# Altium schematic sheet ADC-DAC.SchDoc
size A3; SheetNumber: 16; SheetTotal: 18
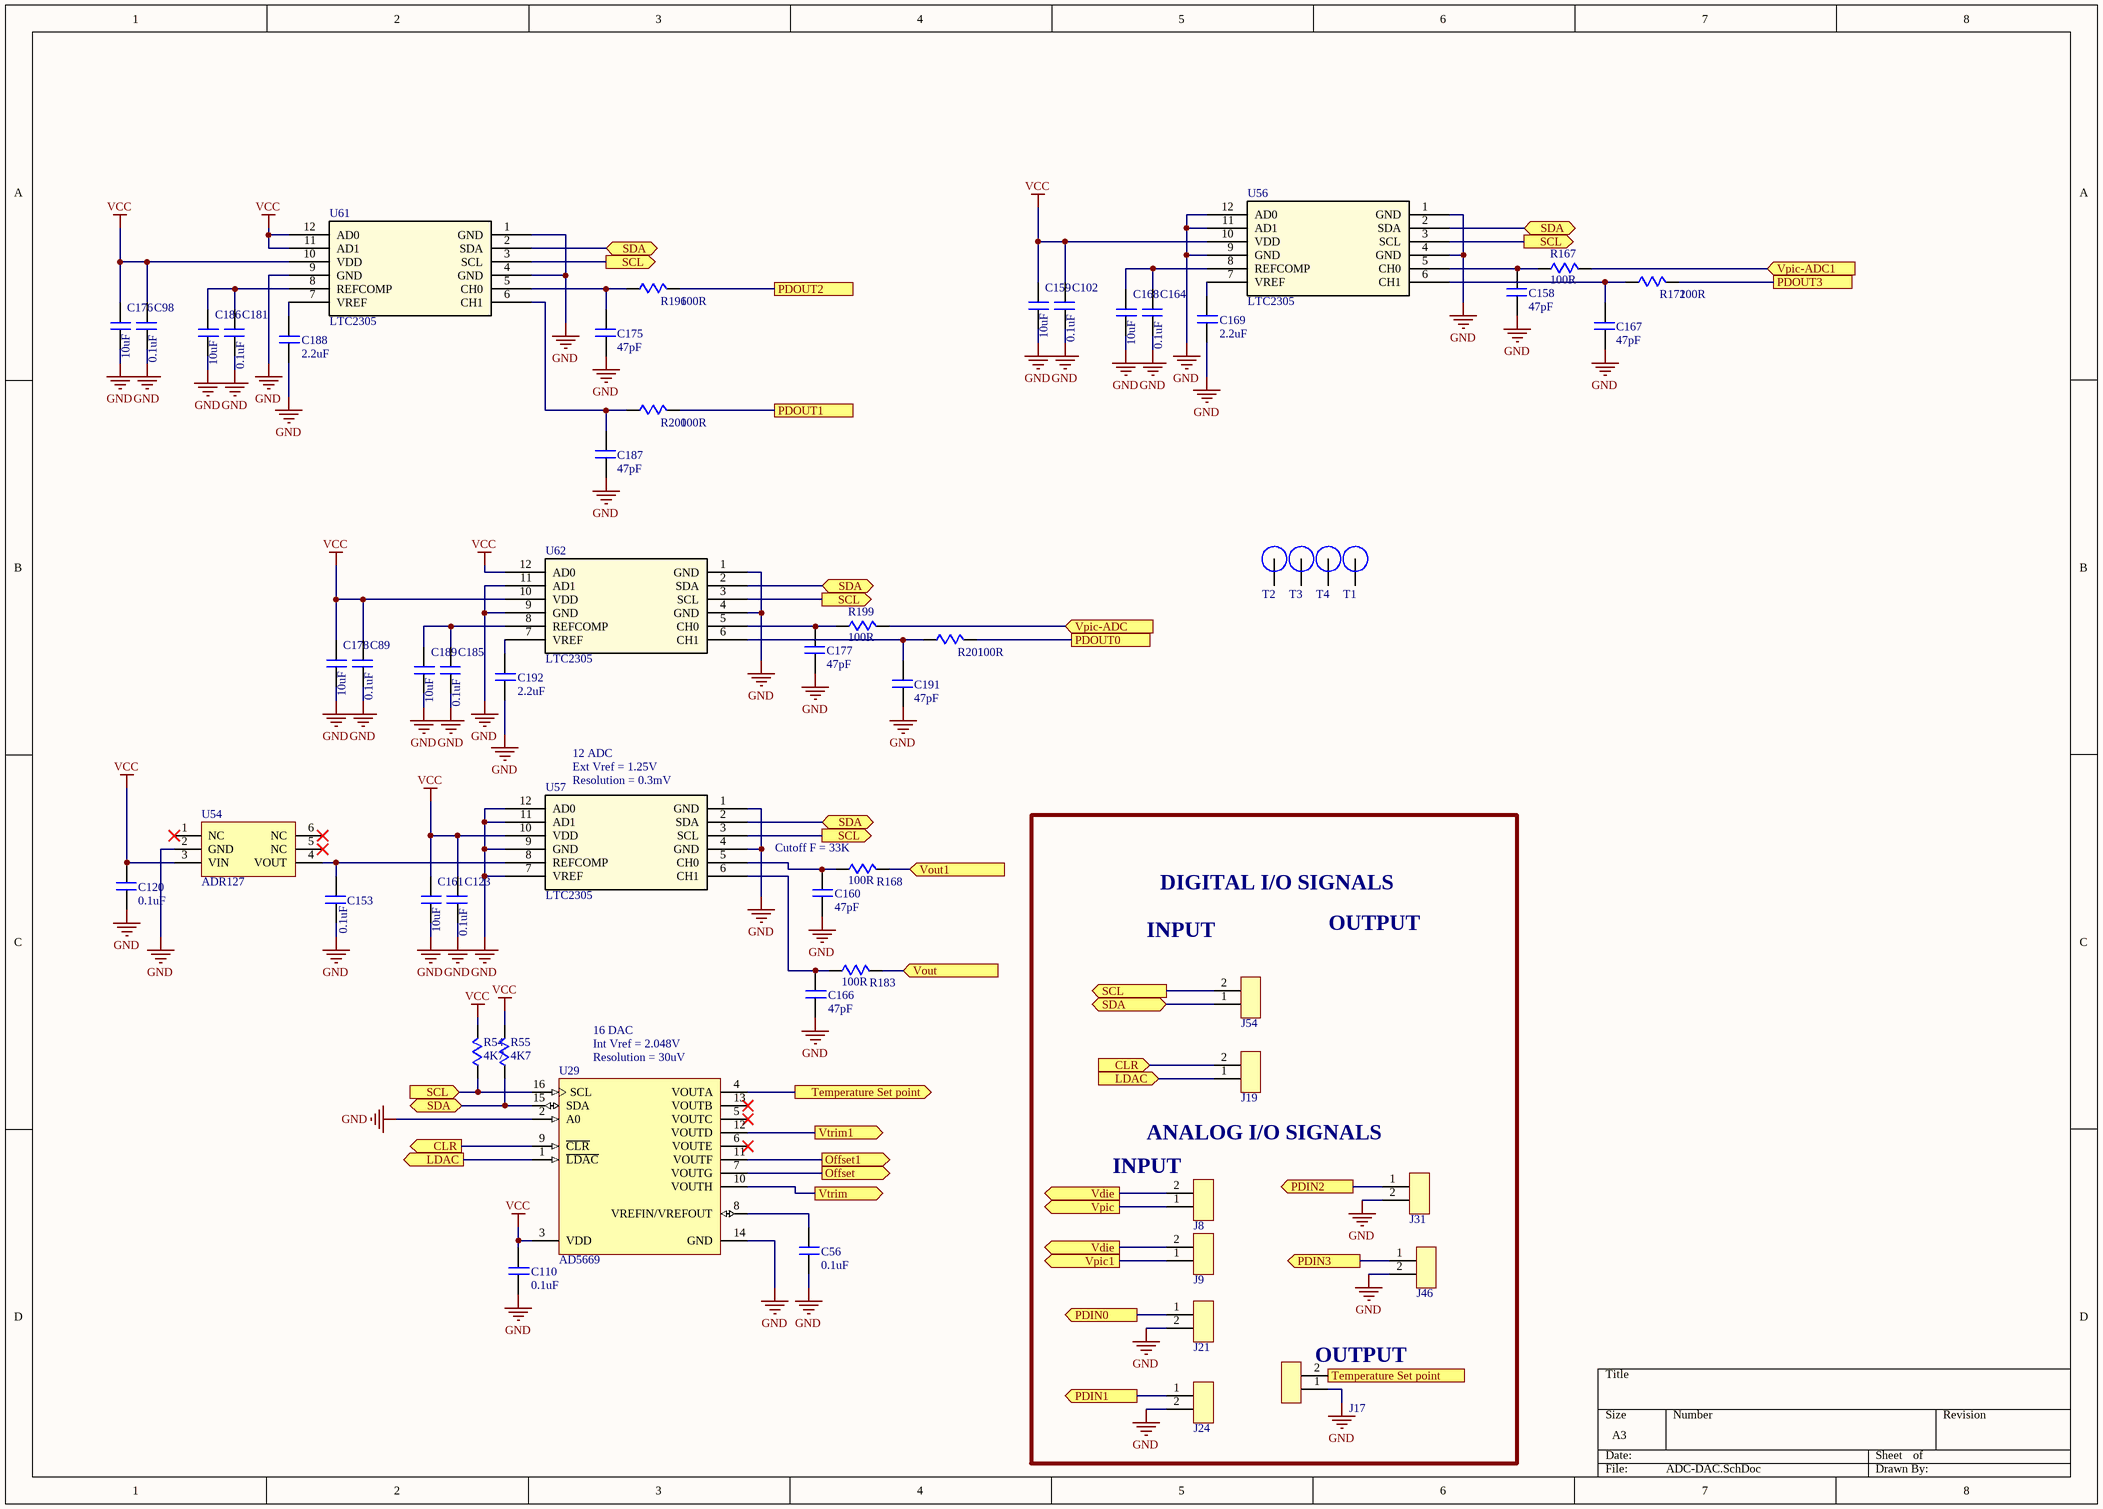
[diagram p0: ADC-DAC.SchDoc]

## Parts
C56  0.1uF  [CAP0603]
C89  0.1uF  [CAP0603]
C98  0.1uF  [CAP0603]
C102  0.1uF  [CAP0603]
C110  0.1uF  [CAP0603]
C120  0.1uF  [CAP0603]
C123  0.1uF  [CAP0603]
C153  0.1uF  [CAP0603]
C158  47pF  [CAP0805]
C159  10uF  [CAP0805]
C160  47pF  [CAP0805]
C161  10uF  [CAP0805]
C164  0.1uF  [CAP0603]
C166  47pF  [CAP0805]
C167  47pF  [CAP0805]
C168  10uF  [CAP0805]
C169  2.2uF  [CAP0603]
C175  47pF  [CAP0805]
C176  10uF  [CAP0805]
C177  47pF  [CAP0805]
C178  10uF  [CAP0805]
C181  0.1uF  [CAP0603]
C185  0.1uF  [CAP0603]
C186  10uF  [CAP0805]
C187  47pF  [CAP0805]
C188  2.2uF  [CAP0603]
C189  10uF  [CAP0805]
C191  47pF  [CAP0805]
C192  2.2uF  [CAP0603]
J8  Header1x2  [HEADER 1x2]  (value not drawn)
J9  Header1x2  [HEADER 1x2]  (value not drawn)
J17  Header1x2  [HEADER 1x2]  (value not drawn)
J19  Header1x2  [HEADER 1x2]  (value not drawn)
J21  Header1x2  [HEADER 1x2]  (value not drawn)
J24  Header1x2  [HEADER 1x2]  (value not drawn)
J31  Header1x2  [HEADER 1x2]  (value not drawn)
J46  Header1x2  [HEADER 1x2]  (value not drawn)
J54  Header1x2  [HEADER 1x2]  (value not drawn)
R54  4K7  [RES0805]
R55  4K7  [RES0805]
R167  100R  [RES0805]
R168  100R  [RES0805]
R172  100R  [RES0805]
R183  100R  [RES0805]
R196  100R  [RES0805]
R199  100R  [RES0805]
R200  100R  [RES0805]
R201  100R  [RES0805]
T1  TP  [Hole 3.3mm]  (value not drawn)
T2  TP  [Hole 3.3mm]  (value not drawn)
T3  TP  [Hole 3.3mm]  (value not drawn)
T4  TP  [Hole 3.3mm]  (value not drawn)
U29  AD5669  [TSSOP16]
U54  ADR127  [TSOT6]
U56  LTC2305  [MSOP12]
U57  LTC2305  [MSOP12]
U61  LTC2305  [MSOP12]
U62  LTC2305  [MSOP12]

## Ports
CLR (in, see ADC-DAC[2D]), CLR (out, see ADC-DAC[5C]), LDAC (in, see ADC-DAC[2D]), LDAC (out, see ADC-DAC[5C]), Offset1 (out, see PIC closed loop[1C]), Offset (out, see PIC closed loop[1B]), PDIN0 (out, see PD[1A]), PDIN1 (out, see PD[1B]), PDIN2 (out, see PD[1C]), PDIN3 (out, see PD[1D]), PDOUT0 (see PD[4A]), PDOUT1 (see PD[4B]), PDOUT2 (see PD[4C]), PDOUT3 (see PD[4D]), SCL (in, see ADC-DAC[3A], ADC-DAC[4B], ADC-DAC[4C], ADC-DAC[5C], ADC-DAC[6A], Fan & Power Out[6A], PI_INTERFACE[3A], TEC_CONTROLLER_1[6B], TEC_CONTROLLER_1[7A], TEC_CONTROLLER_1[8B]), SCL (out, see ADC-DAC[2C], ADC-DAC[3A], ADC-DAC[4B], ADC-DAC[4C], ADC-DAC[5C], Fan & Power Out[6A], PI_INTERFACE[3A], TEC_CONTROLLER_1[6B], TEC_CONTROLLER_1[7A], TEC_CONTROLLER_1[8B]), SCL (out, see ADC-DAC[2C], ADC-DAC[3A], ADC-DAC[4B], ADC-DAC[4C], ADC-DAC[6A], Fan & Power Out[6A], PI_INTERFACE[3A], TEC_CONTROLLER_1[6B], TEC_CONTROLLER_1[7A], TEC_CONTROLLER_1[8B]), SCL (out, see ADC-DAC[2C], ADC-DAC[3A], ADC-DAC[4B], ADC-DAC[5C], ADC-DAC[6A], Fan & Power Out[6A], PI_INTERFACE[3A], TEC_CONTROLLER_1[6B], TEC_CONTROLLER_1[7A], TEC_CONTROLLER_1[8B]), SCL (out, see ADC-DAC[2C], ADC-DAC[3A], ADC-DAC[4C], ADC-DAC[5C], ADC-DAC[6A], Fan & Power Out[6A], PI_INTERFACE[3A], TEC_CONTROLLER_1[6B], TEC_CONTROLLER_1[7A], TEC_CONTROLLER_1[8B]), SCL (out, see ADC-DAC[2C], ADC-DAC[4B], ADC-DAC[4C], ADC-DAC[5C], ADC-DAC[6A], Fan & Power Out[6A], PI_INTERFACE[3A], TEC_CONTROLLER_1[6B], TEC_CONTROLLER_1[7A], TEC_CONTROLLER_1[8B]), SDA (bidir, see ADC-DAC[2C], ADC-DAC[3A], ADC-DAC[4B], ADC-DAC[4C], ADC-DAC[5C], Fan & Power Out[6A], PI_INTERFACE[3A], TEC_CONTROLLER_1[6B], TEC_CONTROLLER_1[7A], TEC_CONTROLLER_1[7B]), SDA (bidir, see ADC-DAC[2C], ADC-DAC[3A], ADC-DAC[4B], ADC-DAC[4C], ADC-DAC[6A], Fan & Power Out[6A], PI_INTERFACE[3A], TEC_CONTROLLER_1[6B], TEC_CONTROLLER_1[7A], TEC_CONTROLLER_1[7B]), SDA (bidir, see ADC-DAC[2C], ADC-DAC[3A], ADC-DAC[4B], ADC-DAC[5C], ADC-DAC[6A], Fan & Power Out[6A], PI_INTERFACE[3A], TEC_CONTROLLER_1[6B], TEC_CONTROLLER_1[7A], TEC_CONTROLLER_1[7B]), SDA (bidir, see ADC-DAC[2C], ADC-DAC[3A], ADC-DAC[4C], ADC-DAC[5C], ADC-DAC[6A], Fan & Power Out[6A], PI_INTERFACE[3A], TEC_CONTROLLER_1[6B], TEC_CONTROLLER_1[7A], TEC_CONTROLLER_1[7B]), SDA (bidir, see ADC-DAC[2C], ADC-DAC[4B], ADC-DAC[4C], ADC-DAC[5C], ADC-DAC[6A], Fan & Power Out[6A], PI_INTERFACE[3A], TEC_CONTROLLER_1[6B], TEC_CONTROLLER_1[7A], TEC_CONTROLLER_1[7B]), SDA (bidir, see ADC-DAC[3A], ADC-DAC[4B], ADC-DAC[4C], ADC-DAC[5C], ADC-DAC[6A], Fan & Power Out[6A], PI_INTERFACE[3A], TEC_CONTROLLER_1[6B], TEC_CONTROLLER_1[7A], TEC_CONTROLLER_1[7B]), Temperature Set point (out, see ADC-DAC[4C]), Temperature Set point (out, see ADC-DAC[6D]), Vdie (out, see ADC-DAC[4D]), Vout1 (in, see PIC closed loop[2C]), Vout (in, see PIC closed loop[3A]), Vpic1 (out, see PIC closed loop[1C]), Vpic (out, see PIC closed loop[1A]), Vpic-ADC1 (in, see PIC closed loop[1C]), Vpic-ADC (in, see PIC closed loop[1A]), Vtrim1 (out, see PIC closed loop[1C]), Vtrim (out, see PIC closed loop[1B])

## Nets
GND: C56.2 C89.2 C98.2 C102.2 C110.2 C120.2 C123.2 C153.2 C158.1 C159.2 C160.2 C161.2 C164.2 C166.2 C167.1 C168.2 C169.2 C175.1 C176.2 C177.1 C178.2 C181.2 C185.2 C186.2 C187.1 C188.2 C189.2 C191.1 C192.2 J17.1 J21.2 J24.2 J31.2 J46.2 U29.2(A0) U29.14(GND) U54.2(GND) U56.1(GND) U56.4(GND) U56.9(GND) U56.11(AD1) U56.12(AD0) U57.1(GND) U57.4(GND) U57.7(VREF) U57.9(GND) U57.11(AD1) U57.12(AD0) U61.1(GND) U61.4(GND) U61.9(GND) U62.1(GND) U62.4(GND) U62.9(GND) U62.11(AD1)
VCC: C89.1 C98.1 C102.1 C110.1 C120.1 C123.1 C159.1 C161.1 C176.1 C178.1 R54.2 R55.2 U29.3(VDD) U54.3(VIN) U56.10(VDD) U57.10(VDD) U61.10(VDD) U61.11(AD1) U61.12(AD0) U62.10(VDD) U62.12(AD0)
CLR: J19.2 U29.9(~{CLR}) ; port CLR
LDAC: J19.1 U29.1(~{LDAC}) ; port LDAC
Offset: U29.7(VOUTG) ; port Offset
Offset1: U29.11(VOUTF) ; port Offset1
PDIN0: J21.1 ; port PDIN0
PDIN1: J24.1 ; port PDIN1
PDIN2: J31.1 ; port PDIN2
PDIN3: J46.1 ; port PDIN3
PDOUT0: R201.2 ; port PDOUT0
PDOUT1: R200.2 ; port PDOUT1
PDOUT2: R196.2 ; port PDOUT2
PDOUT3: R172.2 ; port PDOUT3
SCL: J54.2 R54.1 U29.16(SCL) U56.3(SCL) U57.3(SCL) U61.3(SCL) U62.3(SCL) ; port SCL
SDA: J54.1 R55.1 U29.15(SDA) U56.2(SDA) U57.2(SDA) U61.2(SDA) U62.2(SDA) ; port SDA
Temperature Set point: J17.2 U29.4(VOUTA) ; port Temperature Set point
Vdie: J8.2 J9.2 ; port Vdie
Vout: R183.2 ; port Vout
Vout1: R168.2 ; port Vout1
Vpic: J8.1 ; port Vpic
Vpic1: J9.1 ; port Vpic1
Vpic-ADC: R199.2 ; port Vpic-ADC
Vpic-ADC1: R167.2 ; port Vpic-ADC1
Vtrim: U29.10(VOUTH) ; port Vtrim
Vtrim1: U29.12(VOUTD) ; port Vtrim1
NetC56_1: C56.1 U29.8(VREFIN/VREFOUT)
NetC153_1: C153.1 U54.4(VOUT) U57.8(REFCOMP)
NetC158_2: C158.2 R167.1 U56.5(CH0)
NetC160_1: C160.1 R168.1 U57.5(CH0)
NetC164_1: C164.1 C168.1 U56.8(REFCOMP)
NetC166_1: C166.1 R183.1 U57.6(CH1)
NetC167_2: C167.2 R172.1 U56.6(CH1)
NetC169_1: C169.1 U56.7(VREF)
NetC175_2: C175.2 R196.1 U61.5(CH0)
NetC177_2: C177.2 R199.1 U62.5(CH0)
NetC181_1: C181.1 C186.1 U61.8(REFCOMP)
NetC185_1: C185.1 C189.1 U62.8(REFCOMP)
NetC187_2: C187.2 R200.1 U61.6(CH1)
NetC188_1: C188.1 U61.7(VREF)
NetC191_2: C191.2 R201.1 U62.6(CH1)
NetC192_1: C192.1 U62.7(VREF)

Not connected (* = marked no-connect by the designer): T1 1; T2 1; T3 1; T4 1; U29 5(VOUTC)* 6(VOUTE)* 13(VOUTB)*; U54 1(NC)* 5(NC)* 6(NC)*

## Notes on the sheet
- (near U57) Ext Vref = 1.25V
- (near U57) 12 ADC
- (near U57) Resolution = 0.3mV
- (near R168) Cutoff F = 33K
- DIGITAL I/O SIGNALS
- INPUT
- OUTPUT
- (near U29) Int Vref = 2.048V
- 16 DAC
- (near U29) Resolution = 30uV
- (near J8) INPUT
- ANALOG I/O SIGNALS
- (near J17) OUTPUT

## Library data of the parts
C56 C89 C98 C102 C110 C120 C123 C153 C164 C181 C185 = Capacitor 0.1uF: 50V 100nF X5R 卤10% 0603 Multilayer Ceramic Capacitors MLCC - SMD/SMT ROHS; Manufacturer: TDK; Manufacturer Part Number: C1608X5R1H104K080AA; Material: 4241ConductorMaterial; Tolerance: 10%; Supplier: Mouser; Supplier Part Number: 810-C1608X5R1H104K; RoHS: Yes; Category: Ceramic Capacitors; Stock: 239770; Pricing: 1=0.1, 10=0.051, 50=0.051, 100=0.031, 1000=0.021, 10000=0.012 (USD); Mounting Technology: Surface Mount; Case/Package: 0603; Pins: 2NUMBER; Case Code (Metric): 1608; Case Code (Imperial): 0603; Weight: 7.1E-05oz; Dielectric Material: 4241ConductorMaterial; Min Operating Temperature: -55°C; Max Operating Temperature: 85°C; Value: 100nF; Voltage Rating: 50V; Package Quantity: 1; Packaging: Tape and Reel; Voltage Rating (DC): 50V; Dielectric: X5R; Termination: SMD/SMT; Series: C; Construction: Flat; Length: 1.6mm; Width: 0.031inch; Height: 0.8mm; Thickness: 0.035inch; Depth: 0.8mm; Radiation Hardening: No; Reach SVHC Compliant: No; RoHS Compliant: Yes; Lead Free: 5697LeadFree; ComponentLink1URL: https://datasheet.ciiva.com/24219/mlcc-commercial-general-en-24219452.pdf?src-supplier=Mouser; ComponentLink1Description: https://datasheet.ciiva.com/24219/mlcc-commercial-general-en-24219452.pdf?src-supplier=Mouser; ComponentLink2URL: https://datasheet.ciiva.com/7975/1796654-7975081.pdf?src-supplier=Element14; ComponentLink2Description: https://datasheet.ciiva.com/7975/1796654-7975081.pdf?src-supplier=Element14; ComponentLink3URL: https://datasheet.ciiva.com/22694/1796654-22694121.pdf?src-supplier=Element14; ComponentLink3Description: https://datasheet.ciiva.com/22694/1796654-22694121.pdf?src-supplier=Element14; ComponentLink4URL: https://datasheet.ciiva.com/28577/1735394-28577228.pdf?src-supplier=Element14; ComponentLink4Description: https://datasheet.ciiva.com/28577/1735394-28577228.pdf?src-supplier=Element14; ComponentLink5URL: https://datasheet.ciiva.com/6275/tdkmlcccaprange-6275223.pdf?src-supplier=Digikey; ComponentLink5Description: https://datasheet.ciiva.com/6275/tdkmlcccaprange-6275223.pdf?src-supplier=Digikey; Supplier 1: Mouser; Supplier Part Number 1: 810-C1608X5R1H104K
C158 C160 C166 C167 C175 C177 C187 C191 = Capactior 47pF: Cap Cer 4.7PF 100V C0G/NP0 0805; Manufacturer: Wurth Electronics; Manufacturer Part Number: 885012007096; Insulation Resistance: 10GR; Supplier: Mouser; Supplier Part Number: 710-885012007096; RoHS: No; Category: Ceramic Capacitors; Stock: 8470; Voltage Rating (DC): 100V; Length: 2mm; Width: 1.25mm; Height: 600um; ComponentLink1URL: http://www.farnell.com/datasheets/2546659.pdf?src-supplier=Farnell; ComponentLink1Description: http://www.farnell.com/datasheets/2546659.pdf?src-supplier=Farnell; ComponentLink2URL: https://katalog.we-online.de/pbs/datasheet/885012007096.pdf?src-supplier=Digikey; ComponentLink2Description: https://katalog.we-online.de/pbs/datasheet/885012007096.pdf?src-supplier=Digikey; Supplier 1: Mouser; Supplier Part Number 1: 710-885012007096
C159 C161 C168 C176 C178 C186 C189 = Capacitor 10uF: SMD Multilayer Ceramic Capacitor, 10 ï¿½F, 25 V, 0805 [2012 Metric], ï¿½ 10%, X7S; Manufacturer: TDK; Manufacturer Part Number: C2012X7S1E106K125AC; Material: 4241ConductorMaterial; Dielectric: 1542DielectricType; Voltage Rating: 25V; Supplier: Mouser; Supplier Part Number: 810-C2012X7S1EK125AC; RoHS: Yes; Category: Ceramic Capacitors; Stock: 53732; Pricing: 1=0.54, 10=0.331, 50=0.331, 100=0.224, 1000=0.169, 10000=0.136 (USD); Case/Package: 339Case; Case Code (Metric): 3663CaseCodeMetric; Min Operating Temperature: -55°C; Max Operating Temperature: 125°C; Value: 10uF; Tolerance: 10%; Voltage Rating (DC): 25V; Length: 2mm; Width: 1.25mm; Height: 1.5mm; Thickness: 1.25mm; Lead Free: 5697LeadFree; ComponentLink1URL: https://product.tdk.com/info/en/catalog/datasheets/mlcc_commercial_general_en.pdf?ref_disty=digikey&src-supplier=Digikey; ComponentLink1Description: https://product.tdk.com/info/en/catalog/datasheets/mlcc_commercial_general_en.pdf?ref_disty=digikey&src-supplier=Digikey; ComponentLink2URL: https://datasheet.octopart.com/C2012X7S1E106K125AC-TDK-datasheet-152726810.pdf?src-supplier=Future+Electronics; ComponentLink2Description: https://datasheet.octopart.com/C2012X7S1E106K125AC-TDK-datasheet-152726810.pdf?src-supplier=Future+Electronics; Supplier 1: Mouser; Supplier Part Number 1: 810-C2012X7S1EK125AC
C169 C188 C192 = Capacitor 2.2uF: Multilayer Ceramic Capacitors (High dielectric type), 16V, 2.2 uF, ± 20 %, 0603, X5R, RoHS; Manufacturer: Taiyo Yuden; Manufacturer Part Number: EMK107BJ225MA-T; Supplier 1: Mouser; Supplier Part Number 1: 963-EMK107BJ225MA-T; Supplier: Mouser; Supplier Part Number: 963-EMK107BJ225MA-T; RoHS: Yes; Category: Ceramic Capacitors; Stock: 26652; Pricing: 1=0.1, 10=0.039, 50=0.039, 100=0.033, 1000=0.022, 10000=0.014 (USD); ComponentLink1URL: http://ds.yuden.co.jp/TYCOMPAS/ut/detail.do?productNo=EMK107BJ225MA-T&fileName=EMK107BJ225MA-T_SS&mode=specSheetDownload&src-supplier=Digikey; ComponentLink1Description: http://ds.yuden.co.jp/TYCOMPAS/ut/detail.do?productNo=EMK107BJ225MA-T&fileName=EMK107BJ225MA-T_SS&mode=specSheetDownload&src-supplier=Digikey; ComponentLink2URL: http://documents.rs-components.com/techlib://itc_doclist_GB.htm?stockno=7583057&src-supplier=Rs; ComponentLink2Description: http://documents.rs-components.com/techlib://itc_doclist_GB.htm?stockno=7583057&src-supplier=Rs; ComponentLink3URL: https://ds.yuden.co.jp/TYCOMPAS/ut/detail?pn=EMK107BJ225MA-T &amp;u=M&src-supplier=Digikey; ComponentLink3Description: https://ds.yuden.co.jp/TYCOMPAS/ut/detail?pn=EMK107BJ225MA-T &amp;u=M&src-supplier=Digikey; ComponentLink4URL: https://datasheet.octopart.com/EMK107BJ225MA-T-Taiyo-Yuden-datasheet-140424376.pdf?src-supplier=Master+Electronics; ComponentLink4Description: https://datasheet.octopart.com/EMK107BJ225MA-T-Taiyo-Yuden-datasheet-140424376.pdf?src-supplier=Master+Electronics
J8 J9 J17 J19 J21 J24 J31 J46 J54 = Header 1x2: Conn Wire to Board HDR 2 POS 2.54mm Solder ST Thru-Hole Bulk; Manufacturer: Molex; Current Rating: 4A; Voltage Rating: 250V; Contact Resistance: 10mR; Number of Positions: 2; Supplier: Mouser; Supplier Part Number: 538-22-23-2022; Manufacturer Part Number: 22-23-2022; RoHS: Yes; Category: Headers and Wire Housings; Stock: 14930; Pricing: 1=0.16, 10=0.144, 50=0.14, 100=0.136, 1000=0.134, 10000=0.134 (USD); Mounting Technology: Through Hole; Case/Package: 100; Contact Plating: Tin; Contact Material: Brass; Housing Material: Polyamide; Min Operating Temperature: 0°C; Max Operating Temperature: 75°C; Package Quantity: 3000; Number of Rows: 1; Termination: Through Hole; Number of Contacts: 2; Orientation: Straight; Series: 6373; Pitch: 2.54mm; RoHS Compliant: Yes; ComponentLink1URL: http://datasheet.octopart.com/22-23-2022-Molex-datasheet-154765248.pdf?src-supplier=Avnet; ComponentLink1Description: http://datasheet.octopart.com/22-23-2022-Molex-datasheet-154765248.pdf?src-supplier=Avnet; ComponentLink2URL: http://datasheet.octopart.com/22-23-2022-Molex-datasheet-154765248.pdf?src-supplier=Digikey; ComponentLink2Description: http://datasheet.octopart.com/22-23-2022-Molex-datasheet-154765248.pdf?src-supplier=Digikey; ComponentLink3URL: http://datasheet.octopart.com/22-23-2022-Molex-datasheet-154765248.pdf?src-supplier=Onlinecomponents.com; ComponentLink3Description: http://datasheet.octopart.com/22-23-2022-Molex-datasheet-154765248.pdf?src-supplier=Onlinecomponents.com; ComponentLink4URL: http://datasheet.octopart.com/22-23-2022-Molex-datasheet-154765248.pdf?src-supplier=Mouser; ComponentLink4Description: http://datasheet.octopart.com/22-23-2022-Molex-datasheet-154765248.pdf?src-supplier=Mouser; ComponentLink5URL: http://datasheet.octopart.com/22-23-2022-Molex-datasheet-154765248.pdf?src-supplier=Newark; ComponentLink5Description: http://datasheet.octopart.com/22-23-2022-Molex-datasheet-154765248.pdf?src-supplier=Newark; ComponentLink6URL: https://datasheet.octopart.com/0022232022-Molex-datasheet-137053720.pdf?src-supplier=Sager+Electronics; ComponentLink6Description: https://datasheet.octopart.com/0022232022-Molex-datasheet-137053720.pdf?src-supplier=Sager+Electronics; ComponentLink7URL: https://datasheet.octopart.com/22-23-2022-Molex-datasheet-26579529.pdf?src-supplier=Electro+Sonic; ComponentLink7Description: https://datasheet.octopart.com/22-23-2022-Molex-datasheet-26579529.pdf?src-supplier=Electro+Sonic; ComponentLink8URL: https://datasheet.octopart.com/22-23-2022-Molex-datasheet-154765248.pdf?src-supplier=Master+Electronics; ComponentLink8Description: https://datasheet.octopart.com/22-23-2022-Molex-datasheet-154765248.pdf?src-supplier=Master+Electronics; ComponentLink9URL: http://datasheet.octopart.com/22-23-2022-Molex-datasheet-154765248.pdf?src-supplier=Heilind+Electronics; ComponentLink9Description: http://datasheet.octopart.com/22-23-2022-Molex-datasheet-154765248.pdf?src-supplier=Heilind+Electronics
R54 R55 = Resistor 4.7K: Res Thin Film 0805 4.7K Ohm 0.1% 0.125W(1/8W) ±50ppm/C Epoxy Pad SMD T/R; Manufacturer: Yageo; Manufacturer Part Number: RT0805BRE074K7L; Value: 4.7kR; Max Power Dissipation: 125mW; Temperature Coefficient: 50ppm/°C; Voltage Rating (DC): 150V; Supplier 1: Mouser; Supplier Part Number 1: 603-RT0805BRE074K7L; Supplier: Mouser; Supplier Part Number: 603-RT0805BRE074K7L; RoHS: Yes; Category: Chip SMD Resistors; Stock: 4540; Case/Package: 0805; Contact Plating: Tin,Matte; Min Operating Temperature: -55°C; Max Operating Temperature: 125°C; Tolerance: 0.1%; Packaging: Tape and Reel; Package Quantity: 5000; Number of Terminations: 2; Series: RT; Voltage Rating: 150V; Length: 0.079inch; Width: 0.049inch; Height: 0.024inch; Lead Free: Lead Free; RoHS Compliant: Yes; ComponentLink1URL: https://datasheet.ciiva.com/2591/pyu-rt-1-to-0-05-rohs-l-5-2591828.pdf?src-supplier=Digikey; ComponentLink1Description: https://datasheet.ciiva.com/2591/pyu-rt-1-to-0-05-rohs-l-5-2591828.pdf?src-supplier=Digikey; ComponentLink2URL: https://datasheet.ciiva.com/8892/pyu-rt-1-to-0-05-rohs-l-4-8892981.pdf?src-supplier=Avnet; ComponentLink2Description: https://datasheet.ciiva.com/8892/pyu-rt-1-to-0-05-rohs-l-4-8892981.pdf?src-supplier=Avnet
R167 R168 R172 R183 R196 R199-R201 = Resistor 100R: High Precision-High Stability Chip Resistor Thin Film 0805 100Ohm 0.5% Paper T/R; Manufacturer: Yageo; Manufacturer Part Number: RT0805DRE07100RL; Max Power Dissipation: 125mW; Temperature Coefficient: 50ppm/°C; Voltage Rating (DC): 150V; Supplier: Mouser; Supplier Part Number: 603-RT0805DRE07100RL; RoHS: Yes; Category: Chip SMD Resistors; Stock: 4479; Case/Package: 0805; Case Code (Metric): 2012; Case Code (Imperial): 0805; Min Operating Temperature: -55°C; Max Operating Temperature: 155°C; Value: 100R; Packaging: Cut Tape; Number of Terminations: 2; Tolerance: 0.5%; Series: RT; Lead Free: Lead Free; RoHS Compliant: Yes; ComponentLink1URL: http://www.yageo.com/documents/recent/PYu-RT_1-to-0.01_RoHS_L_9.pdf?src-supplier=Digikey; ComponentLink1Description: http://www.yageo.com/documents/recent/PYu-RT_1-to-0.01_RoHS_L_9.pdf?src-supplier=Digikey; Supplier 1: Mouser; Supplier Part Number 1: 603-RT0805DRE07100RL
T1-T4 = Mount hole 3.3mm
U29 = AD5669RARUZ-1: DAC 8-CH Resistor-String 16-bit 16-Pin TSSOP Tube; Manufacturer: Analog Devices; Supplier: Mouser; Supplier Part Number: 584-AD5669RARUZ-1; Manufacturer Part Number: AD5669RARUZ-1; RoHS: Yes; Category: Digital to Analog Converters (DACs); Stock: 17; Pricing: 1=30.21, 10=22.04, 50=19.5, 100=19.5, 1000=19.5, 10000=19.5 (USD); ComponentLink1URL: https://datasheet.ciiva.com/1151/ad5629r-5669r-1151744.pdf?src-supplier=Newark; ComponentLink1Description: https://datasheet.ciiva.com/1151/ad5629r-5669r-1151744.pdf?src-supplier=Newark; ComponentLink2URL: https://datasheet.ciiva.com/1142/1789980-1142832.pdf?src-supplier=Element14; ComponentLink2Description: https://datasheet.ciiva.com/1142/1789980-1142832.pdf?src-supplier=Element14; ComponentLink3URL: https://datasheet.ciiva.com/1368/ad5629r-5669r-1368153.pdf?src-supplier=Digikey; ComponentLink3Description: https://datasheet.ciiva.com/1368/ad5629r-5669r-1368153.pdf?src-supplier=Digikey; ComponentLink4URL: https://datasheet.ciiva.com/8191/ad5629r-5669r-8191993.pdf?src-supplier=Avnet; ComponentLink4Description: https://datasheet.ciiva.com/8191/ad5629r-5669r-8191993.pdf?src-supplier=Avnet; Supplier 1: Mouser; Supplier Part Number 1: 584-AD5669RARUZ-1
U54 = ADR127BUJZ-REEL7: Precision, Micropower LD0 1.25 VOUT Voltage Reference in TSOT; Manufacturer: Analog Devices; Supplier: Mouser; Supplier Part Number: 584-ADR127BUJZ-R7; Manufacturer Part Number: ADR127BUJZ-REEL7; RoHS: Yes; Category: Voltage References; Stock: 1572; ComponentLink1URL: https://datasheet.ciiva.com/22666/705367-22666165.pdf?src-supplier=Element14; ComponentLink1Description: https://datasheet.ciiva.com/22666/705367-22666165.pdf?src-supplier=Element14; ComponentLink2URL: https://datasheet.ciiva.com/3236/adr121-125-127-3236921.pdf?src-supplier=Avnet; ComponentLink2Description: https://datasheet.ciiva.com/3236/adr121-125-127-3236921.pdf?src-supplier=Avnet; ComponentLink3URL: https://datasheet.ciiva.com/2005/adr121-125-127-2005786.pdf?src-supplier=Digikey; ComponentLink3Description: https://datasheet.ciiva.com/2005/adr121-125-127-2005786.pdf?src-supplier=Digikey; ComponentLink4URL: https://datasheet.ciiva.com/2005/adr121-125-127-2005788.pdf?src-supplier=Digikey; ComponentLink4Description: https://datasheet.ciiva.com/2005/adr121-125-127-2005788.pdf?src-supplier=Digikey; ComponentLink5URL: https://datasheet.ciiva.com/2005/adr121-125-127-2005787.pdf?src-supplier=Digikey; ComponentLink5Description: https://datasheet.ciiva.com/2005/adr121-125-127-2005787.pdf?src-supplier=Digikey; Supplier 1: Mouser; Supplier Part Number 1: 584-ADR127AUJZ-R7
U56 U57 U61 U62 = LTC2305CMS#PBF: 2-Channel Single ADC SAR 14ksps 12-bit Serial Automotive 12-Pin MSOP Tube; Manufacturer: Analog Devices / Linear Technology; Supplier: Mouser; Supplier Part Number: 584-LTC2305CMS#PBF; Manufacturer Part Number: LTC2305CMS#PBF; RoHS: Yes; Category: Analog to Digital Converters (ADCs); Stock: 78; ComponentLink1URL: https://datasheet.ciiva.com/4031/46671058s8217761n7433-4031713.pdf?src-supplier=Arrow+Electronics; ComponentLink1Description: https://datasheet.ciiva.com/4031/46671058s8217761n7433-4031713.pdf?src-supplier=Arrow+Electronics; ComponentLink2URL: https://datasheet.ciiva.com/22635/1599670-22635120.pdf?src-supplier=Farnell; ComponentLink2Description: https://datasheet.ciiva.com/22635/1599670-22635120.pdf?src-supplier=Farnell; ComponentLink3URL: https://datasheet.ciiva.com/5784/1599670-5784538.pdf?src-supplier=Farnell; ComponentLink3Description: https://datasheet.ciiva.com/5784/1599670-5784538.pdf?src-supplier=Farnell; ComponentLink4URL: https://datasheet.ciiva.com/6662/26767-6662076.pdf?src-supplier=Digikey; ComponentLink4Description: https://datasheet.ciiva.com/6662/26767-6662076.pdf?src-supplier=Digikey